# EAGLE design ATMEGA328PB_EVAL_R2 (EAGLE 9.6.2)
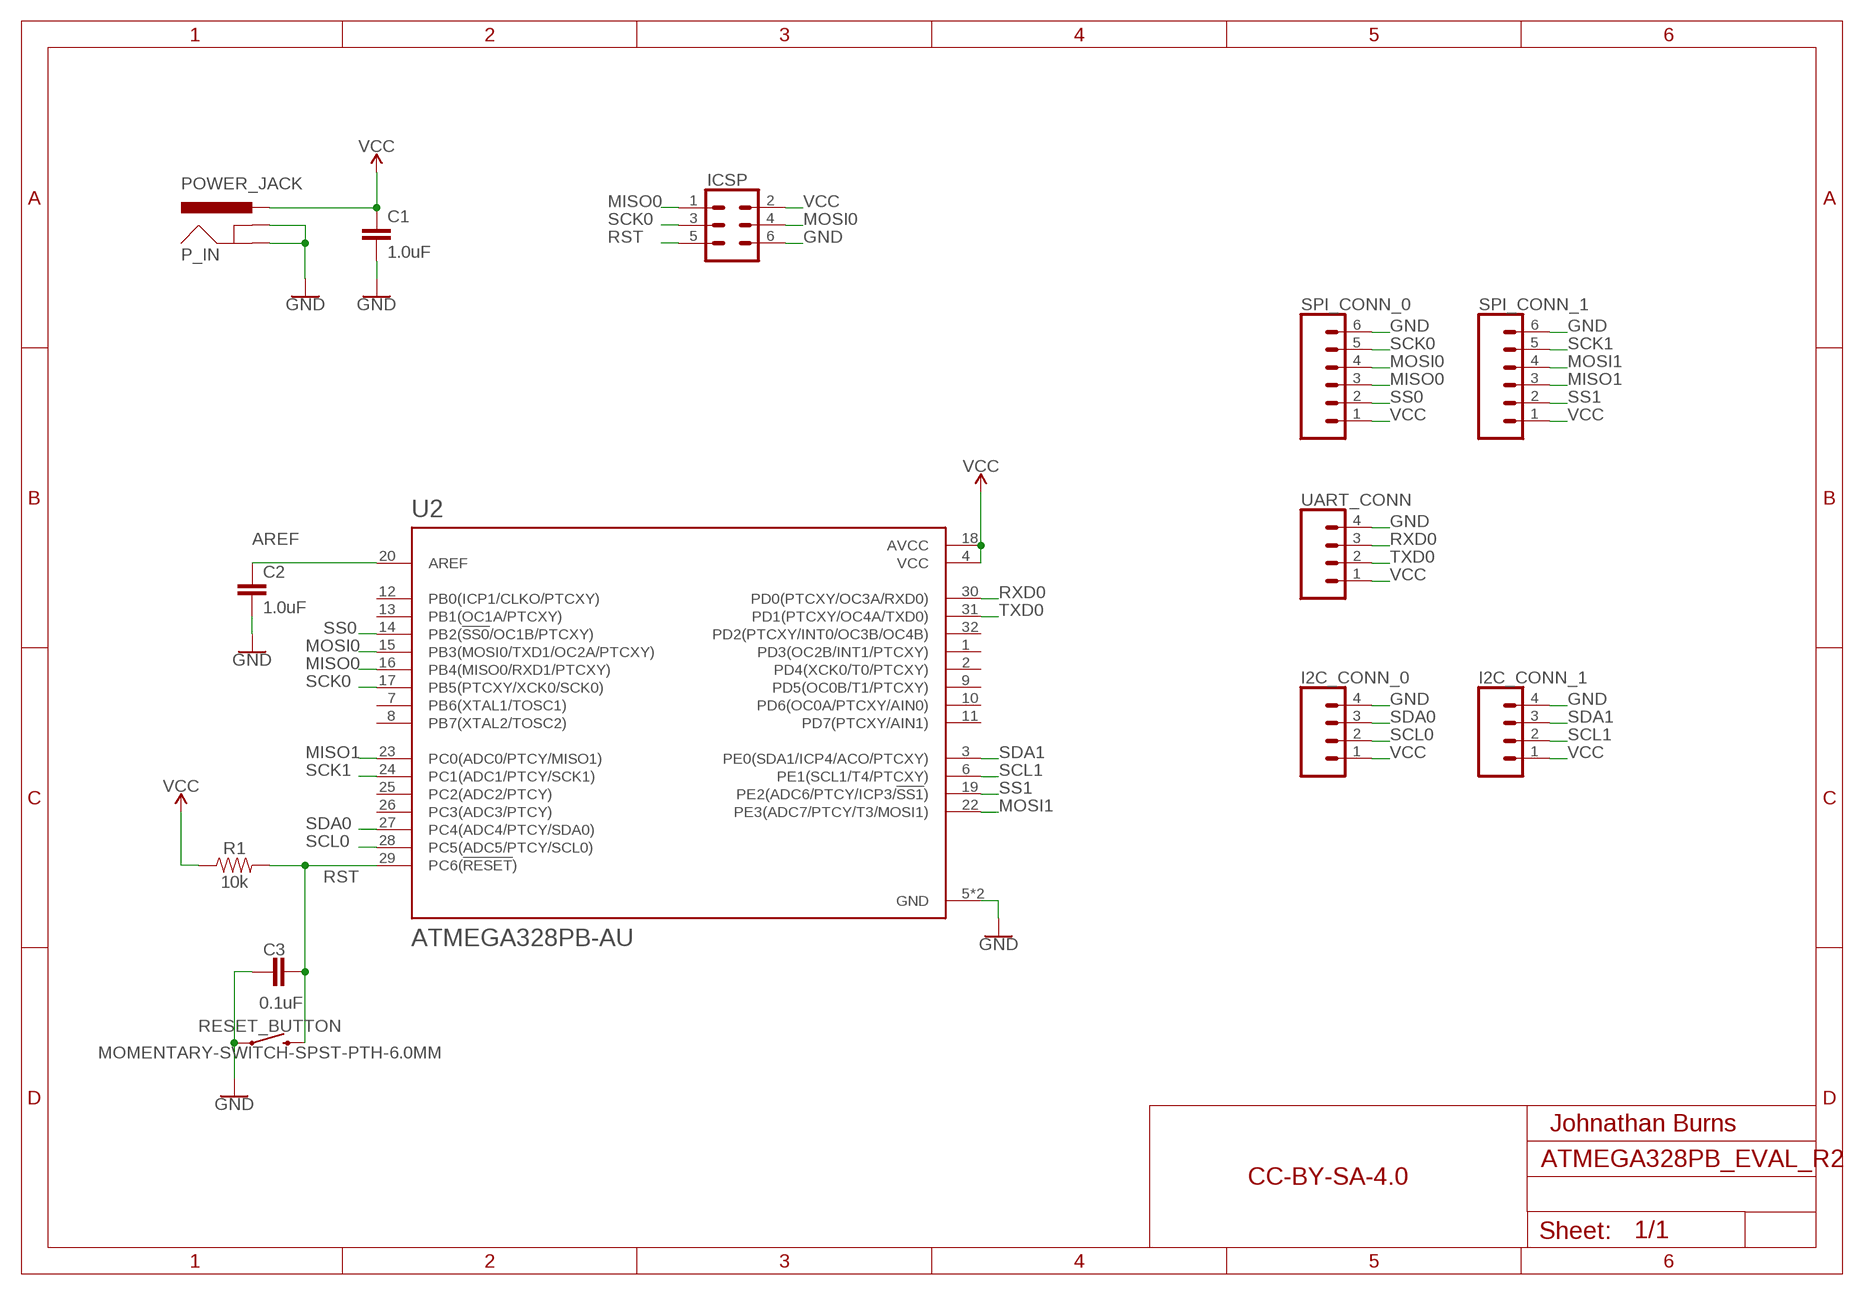
[diagram p0: schematic, sheet 1]

## Parts
C1  1.0uF  1.0UF-0603-16V-10%  [0603]
C2  1.0uF  1.0UF-0603-16V-10%  [0603]
C3  0.1uF  0.1UF-0603-25V-(+80/-20%)  [0603]
I2C_CONN_0  CONN_04  [1X04]
I2C_CONN_1  CONN_04  [1X04]
ICSP  CONN_03X2NO_SILK  [2X3-NS]
P_IN  POWER_JACK  [POWER_JACK_PTH]
R1  10k  10KOHM-0603-1/10W-1%  [0603]
RESET_BUTTON  MOMENTARY-SWITCH-SPST-PTH-6.0MM  [TACTILE_SWITCH_PTH_6.0MM]
SPI_CONN_0  CONN_06SILK_FEMALE_PTH  [1X06]
SPI_CONN_1  CONN_06SILK_FEMALE_PTH  [1X06]
U2  ATMEGA328PB-AU  [QFP80P900X900X120-32N]
UART_CONN  CONN_04  [1X04]

## Nets
AREF: C2.1 U2.20(AREF)
GND: C1.2 C2.2 C3.1 I2C_CONN_0.4 I2C_CONN_1.4 ICSP.6 P_IN.GND P_IN.GNDBREAK RESET_BUTTON.1 SPI_CONN_0.6 SPI_CONN_1.6 U2.5(GND) U2.21(GND) UART_CONN.4
MISO0: ICSP.1 SPI_CONN_0.3 U2.16(PB4(MISO0/RXD1/PTCXY))
MISO1: SPI_CONN_1.3 U2.23(PC0(ADC0/PTCY/MISO1))
MOSI0: ICSP.4 SPI_CONN_0.4 U2.15(PB3(MOSI0/TXD1/OC2A/PTCXY))
MOSI1: SPI_CONN_1.4 U2.22(PE3(ADC7/PTCY/T3/MOSI1))
RST: C3.2 ICSP.5 R1.2 RESET_BUTTON.3 U2.29(PC6(!RESET!))
RXD0: U2.30(PD0(PTCXY/OC3A/RXD0)) UART_CONN.3
SCK0: ICSP.3 SPI_CONN_0.5 U2.17(PB5(PTCXY/XCK0/SCK0))
SCK1: SPI_CONN_1.5 U2.24(PC1(ADC1/PTCY/SCK1))
SCL0: I2C_CONN_0.2 U2.28(PC5(ADC5/PTCY/SCL0))
SCL1: I2C_CONN_1.2 U2.6(PE1(SCL1/T4/PTCXY))
SDA0: I2C_CONN_0.3 U2.27(PC4(ADC4/PTCY/SDA0))
SDA1: I2C_CONN_1.3 U2.3(PE0(SDA1/ICP4/ACO/PTCXY))
SS0: SPI_CONN_0.2 U2.14(PB2(!SS0!/OC1B/PTCXY))
SS1: SPI_CONN_1.2 U2.19(PE2(ADC6/PTCY/ICP3/!SS1!))
TXD0: U2.31(PD1(PTCXY/OC4A/TXD0)) UART_CONN.2
VCC: C1.1 I2C_CONN_0.1 I2C_CONN_1.1 ICSP.2 P_IN.PWR R1.1 SPI_CONN_0.1 SPI_CONN_1.1 U2.4(VCC) U2.18(AVCC) UART_CONN.1
Unconnected: U2.1(PD3(OC2B/INT1/PTCXY)) U2.2(PD4(XCK0/T0/PTCXY)) U2.7(PB6(XTAL1/TOSC1)) U2.8(PB7(XTAL2/TOSC2)) U2.9(PD5(OC0B/T1/PTCXY)) U2.10(PD6(OC0A/PTCXY/AIN0)) U2.11(PD7(PTCXY/AIN1)) U2.12(PB0(ICP1/CLKO/PTCXY)) U2.13(PB1(OC1A/PTCXY)) U2.25(PC2(ADC2/PTCY)) U2.26(PC3(ADC3/PTCY)) U2.32(PD2(PTCXY/INT0/OC3B/OC4B))

## Notes on the sheet
- Johnathan Burns
- CC-BY-SA-4.0

## Library data of the parts
C1 C2 = SparkFun-Capacitors:1.0UF: 1µF ceramic capacitors A capacitor is a passive two-terminal electrical component used to store electrical energy temporarily in an electric field.; PROD_ID: CAP-00868
C3 = SparkFun-Capacitors:0.1UF: 0.1µF ceramic capacitors A capacitor is a passive two-terminal electrical component used to store electrical energy temporarily in an electric field.; PROD_ID: CAP-00810
I2C_CONN_0 I2C_CONN_1 UART_CONN = SparkFun-Connectors:CONN_04: Multi connection point. Often used as Generic Header-pin footprint for 0.1 inch spaced/style header connections On any of the 0.1 inch spaced packages, you can populate with these: Break Away Headers - Straight <https://www.sparkfun.com/products/116> (PRT-00116) Break Away Male Headers - Right Angle <https://www.sparkfun.com/products/553> (PRT-00553) Female Headers <https://www.sparkfun.com/products/115> (PRT-00115) Break Away Headers - Machine Pin <https://www.sparkfun.com/products/117> (PRT-00117) Break Away Female Headers - Swiss Machine Pin <https://www.sparkfun.com/products/743> (PRT-00743) For SCREWTERMINALS and SPRING TERMINALS visit here: Screw Terimnals on SparkFun.com <https://www.sparkfun.com/search/results?term=Screw+Terminals> (5mm/3.5mm/2.54mm spacing) This device is also useful as a general connection point to wire up your design to another part of your project. Our various solder wires solder well into these plated through hole pads. Hook-Up Wire - Assortment (Stranded, 22 AWG) <https://www.sparkfun.com/products/11375> (PRT-11375) Hook-Up Wire - Assortment (Solid Core, 22 AWG) <https://www.sparkfun.com/products/11367> (PRT-11367) View the entire wire category on our website here <https://www.sparkfun.com/categories/141> Special notes: Molex polarized connector foot print use with SKU : PRT-08231 with associated crimp pins and housings. 1MM SMD Version SKU: PRT-10208; PROD_ID: CONN-09696
ICSP = SparkFun-Connectors:CONN_03X2: Multi connection point. Often used as Generic Header-pin footprint for 0.1 inch spaced/style header connections You can populate with any combo of single row headers, but if you'd like an exact match, check these: Header - 2x3 (Male, 0.1") <https://www.sparkfun.com/products/12807> (PRT-12807) Header - 2x3 (Female, 0.1") <https://www.sparkfun.com/products/13010> (PRT-13010) 2x3 Pin Shrouded Header <https://www.sparkfun.com/products/10877> (PRT-10877) On any of the 0.1 inch spaced packages, you can populate with these: Break Away Headers - Straight <https://www.sparkfun.com/products/116> (PRT-00116) Break Away Male Headers - Right Angle <https://www.sparkfun.com/products/553> (PRT-00553) Female Headers <https://www.sparkfun.com/products/115> (PRT-00115) Break Away Headers - Machine Pin <https://www.sparkfun.com/products/117> (PRT-00117) Break Away Female Headers - Swiss Machine Pin <https://www.sparkfun.com/products/743> (PRT-00743) Special note: the shrouded connector mates well with our 3x2 ribbon cables: Ribbon Crimp Connector - 6-pin (2x3, Female) <https://www.sparkfun.com/products/10651> (PRT-10651) Ribbon Cable - 6 wire (15ft) <https://www.sparkfun.com/products/10646> (PRT-10646)
P_IN = SparkFun-Connectors:POWER_JACK: Power Jack Connector This is the standard 5.5mm barrel jack for power. The PTH is the most common, proven, reliable, footprint. The Slot footprint only works if the mill layer is transmitted to the PCB fab house so be warned. Here are the connectors we sell at SparkFun: DC Barrel Power Jack/Connector <https://www.sparkfun.com/products/119> (PRT-00119) DC Barrel Power Jack/Connector (SMD) <https://www.sparkfun.com/products/12748> (PRT-12748) DC Barrel Jack Adapter - Breadboard Compatible <https://www.sparkfun.com/products/10811> (PRT-10811) It is used on this SparkFun product (and many, many others): SparkFun RedBoard - Programmed with Arduino <https://www.sparkfun.com/products/12757> (DEV-12757) Also, if you need a mating power supply or connector, please check these out: Wall Adapter Power Supply - 9VDC 650mA <https://www.sparkfun.com/products/298> (TOL-00298) DC Barrel Jack Adapter - Male <https://www.sparkfun.com/products/10287> (PRT-10287); PROD_ID: CONN-08197
R1 = SparkFun-Resistors:10KOHM: 10kΩ resistor A resistor is a passive two-terminal electrical component that implements electrical resistance as a circuit element. Resistors act to reduce current flow, and, at the same time, act to lower voltage levels within circuits. - Wikipedia; PROD_ID: RES-00824
RESET_BUTTON = SparkFun-Switches:MOMENTARY-SWITCH-SPST: Momentary Switch (Pushbutton) - SPST Normally-open (NO) SPST momentary switches (buttons, pushbuttons). Variants PTH-12MM - 12mm square, through-hole Momentary Pushbutton Switch - 12mm Square <https://www.sparkfun.com/products/9190> (COM-09190) PTH-6.0MM, PTH-6.0MM-KIT - 6.0mm square, through-hole Mini Pushbutton Switch <https://www.sparkfun.com/products/97> (COM-00097) KIT package intended for soldering kit's - only one side of pads' copper is exposed. PTH-RIGHT-ANGLE-KIT - Right-angle, through-hole Right Angle Tactile Button <https://www.sparkfun.com/products/10791> - Used on SparkFun BigTime Watch Kit <https://www.sparkfun.com/products/11734> SMD-12MM - 12mm square, surface-mount Tactile Button - SMD (12mm) <https://www.sparkfun.com/products/12993> (COM-12993) Used on SparkFun PicoBoard <https://www.sparkfun.com/products/11888> SMD-4.5MM - 4.5mm Square Trackball Switch Used on SparkFun Blackberry Trackballer Breakout <https://www.sparkfun.com/products/13169> SMD-4.6MMX2.8MM - 4.60mm x 2.80mm, surface mount Used on SparkFun SAMD21 Mini Breakout <https://www.sparkfun.com/products/13664> SMD-5.2MM, SMD-5.2-REDUNDANT - 5.2mm square, surface-mount Mini Pushbutton Switch - SMD <https://www.sparkfun.com/products/8720> (COM-08720) Used on Arduino Pro Mini <https://www.sparkfun.com/products/11114> REDUNDANT package connects both switch circuits together SMD-6.0X3.5MM - 6.0 x 3.5mm, surface mount Momentary Reset Switch SMD <https://www.sparkfun.com/products/8229> (COM-08229) SMD-6.2MM-TALL - 6.2mm square, surface mount Tactile Button - SMD (6mm) <https://www.sparkfun.com/products/12992> Used on SparkFun Digital Sandbox <https://www.sparkfun.com/products/12651> SMD-RIGHT-ANGLE - Right-angle, surface mount Used on SparkFun Block for Intel® Edison - Arduino <https://www.sparkfun.com/products/13036>; PROD_ID: SWCH-08441; SF_SKU: COM-00097
SPI_CONN_0 SPI_CONN_1 = SparkFun-Connectors:CONN_06: Multi connection point. Often used as Generic Header-pin footprint for 0.1 inch spaced/style header connections On any of the 0.1 inch spaced packages, you can populate with these: Break Away Headers - Straight <https://www.sparkfun.com/products/116> (PRT-00116) Break Away Male Headers - Right Angle <https://www.sparkfun.com/products/553> (PRT-00553) Female Headers <https://www.sparkfun.com/products/115> (PRT-00115) Break Away Headers - Machine Pin <https://www.sparkfun.com/products/117> (PRT-00117) Break Away Female Headers - Swiss Machine Pin <https://www.sparkfun.com/products/743> (PRT-00743) Arduino Stackable Header - 6 Pin <https://www.sparkfun.com/products/9280> (PRT-09280) For SCREWTERMINALS and SPRING TERMINALS visit here: Screw Terimnals on SparkFun.com <https://www.sparkfun.com/search/results?term=Screw+Terminals> (5mm/3.5mm/2.54mm spacing) This device is also useful as a general connection point to wire up your design to another part of your project. Our various solder wires solder well into these plated through hole pads. Hook-Up Wire - Assortment (Stranded, 22 AWG) <https://www.sparkfun.com/products/11375> (PRT-11375) Hook-Up Wire - Assortment (Solid Core, 22 AWG) <https://www.sparkfun.com/products/11367> (PRT-11367) View the entire wire category on our website here <https://www.sparkfun.com/categories/141>; PROD_ID: CONN-08437
U2 = ATMEGA328PB-AU:ATMEGA328PB-AU: ATmega Series 20 MHz 32 KB Flash 2 KB SRAM 8-Bit Microcontroller - TQFP-32 Check prices <https://pricing.snapeda.com/parts/ATMEGA328PB-AU/Microchip%20Technology%20/%20Atmel/view-part?ref=eda>; AVAILABILITY: Not in stock; DESCRIPTION: AVR AVR® ATmega, Functional Safety (FuSa) Microcontroller IC 8-Bit 20MHz 32KB (16K x 16) FLASH 32-TQFP (7x7); MF: Microchip Technology / Atmel; MP: ATMEGA328PB-AU; PACKAGE: TQFP-32 Microchip Technology / Atmel; PRICE: None

## Board
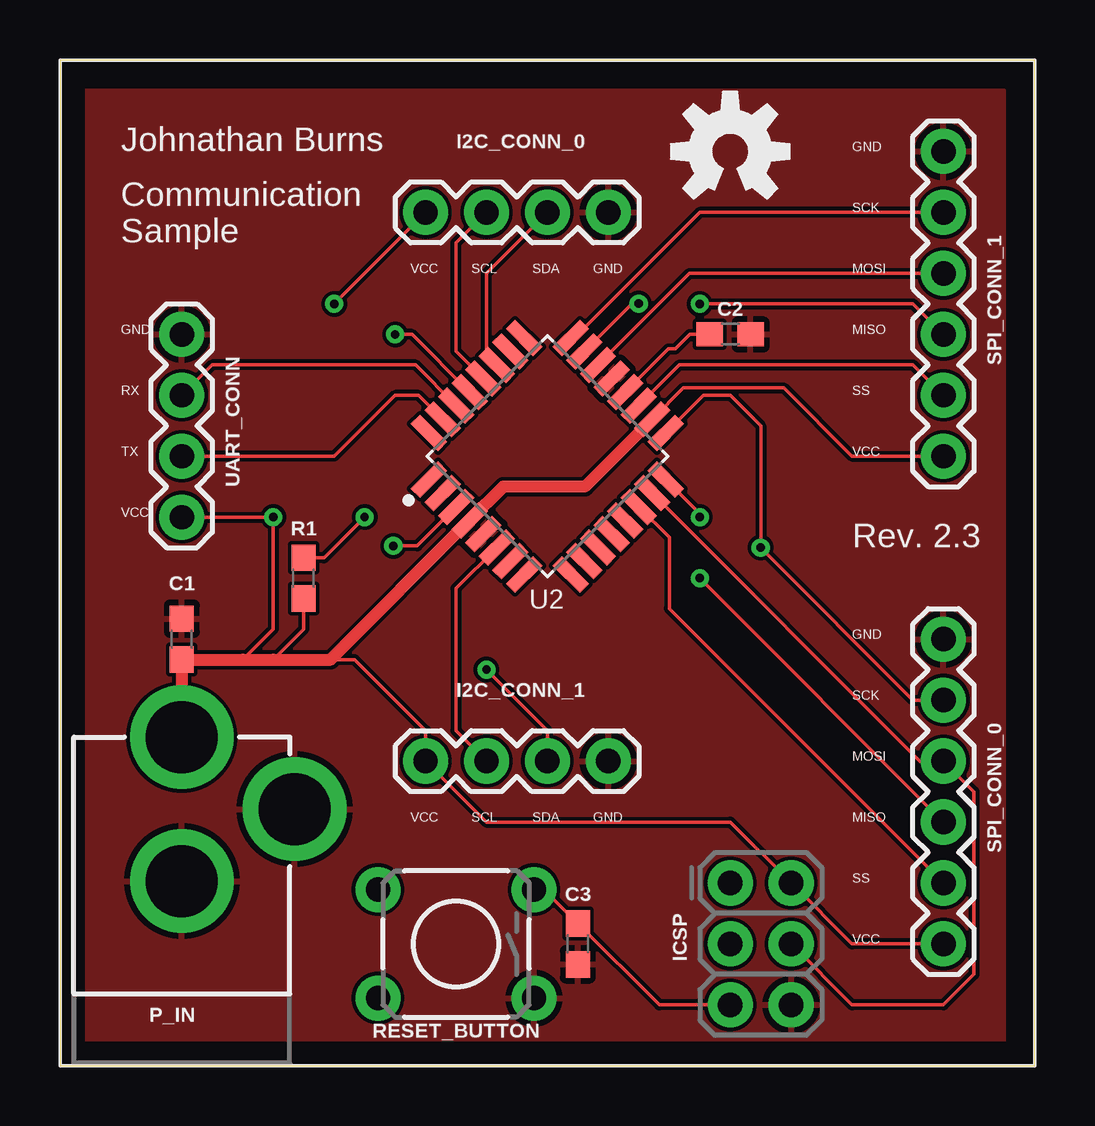
[diagram p1: board, top side]
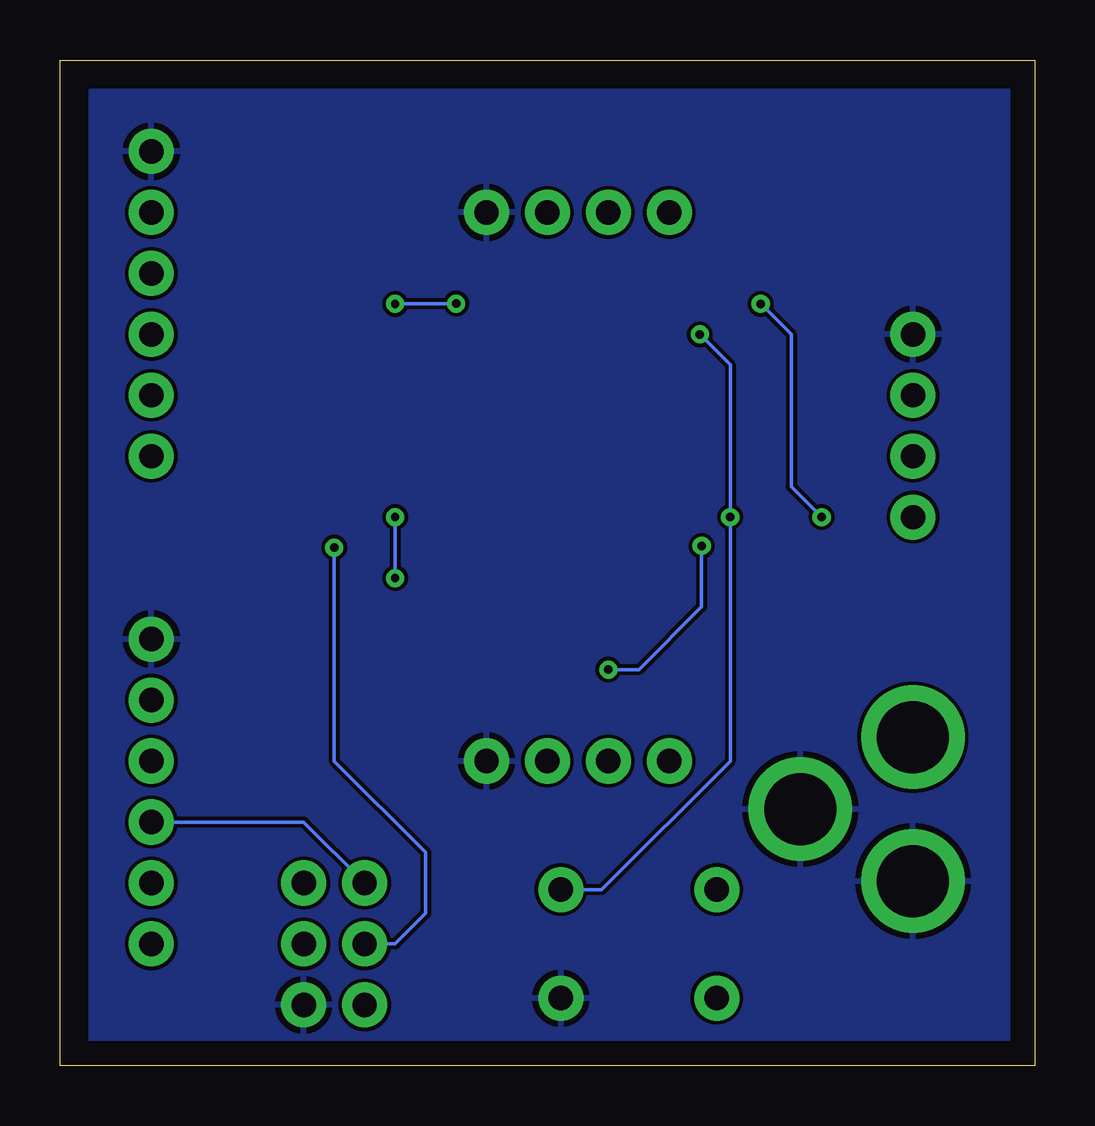
[diagram p2: board, bottom side, seen from below]

Size 40.64 x 41.91 mm. Coordinates in mm from the lower left corner, seen from the top.
Outline: 0,0 40.64,0 40.64,41.91 0,41.91 0,0
Copper layers (1*16): Top 0.035mm / dielectric 1.5mm / Bottom 0.035mm
Design rules "default": minimum track width 6mil, minimum drill 0.35mm, track to track 6mil, track to pad 6mil, pad to pad 6mil, via to via 6mil, smd to smd 6mil, copper to edge 40mil, drill to drill 6mil, minimum pad ring 10mil, minimum via ring 8mil, stop-mask expansion 4mil, vias tented up to drill 0mil, thermal gap 10mil

### Footprints (pad centres in the part's own frame; a part is rotated, then mirrored left to right if it is on the bottom)
0603 = smd 1.1 x 1: 1 -0.85,0; 2 0.85,0
1X04 = drill 1.016 pad 1.88: 1 0,0; 2 2.54,0; 3 5.08,0; 4 7.62,0
2X3-NS = drill 1.016 pad 1.88: 1 -2.54,-1.27; 2 -2.54,1.27; 3 0,-1.27; 4 0,1.27; 5 2.54,-1.27; 6 2.54,1.27
POWER_JACK_PTH = drill 2.997 pad 4.318: GND 0,7.7; GNDBREAK 4.7,10.7; PWR 0,13.7
TACTILE_SWITCH_PTH_6.0MM = drill 1.016 pad 1.88: 1 -3.251,2.261; 2 3.251,2.261; 3 -3.251,-2.261; 4 3.251,-2.261
1X06 = drill 1.016 pad 1.88: 1 0,0; 2 2.54,0; 3 5.08,0; 4 7.62,0; 5 10.16,0; 6 12.7,0
QFP80P900X900X120-32N = smd 1.6 x 0.55: 1 -4.18,2.8; 2 -4.18,2; 3 -4.18,1.2; 4 -4.18,0.4; 5 -4.18,-0.4; 6 -4.18,-1.2; 7 -4.18,-2; 8 -4.18,-2.8; 17 4.18,-2.8; 18 4.18,-2; 19 4.18,-1.2; 20 4.18,-0.4; 21 4.18,0.4; 22 4.18,1.2; 23 4.18,2; 24 4.18,2.8 | smd 0.55 x 1.6: 9 -2.8,-4.18; 10 -2,-4.18; 11 -1.2,-4.18; 12 -0.4,-4.18; 13 0.4,-4.18; 14 1.2,-4.18; 15 2,-4.18; 16 2.8,-4.18; 25 2.8,4.18; 26 2,4.18; 27 1.2,4.18; 28 0.4,4.18; 29 -0.4,4.18; 30 -1.2,4.18; 31 -2,4.18; 32 -2.8,4.18

### Placement (x,y rotation side)
C1  5.08,17.78 90 top
C2  27.94,30.48 0 top
C3  21.59,5.08 90 top
I2C_CONN_0  15.24,35.56 0 top
I2C_CONN_1  15.24,12.7 0 top
ICSP  29.21,5.08 270 top
OSHW_LOGO  [OSHW-LOGO-M]  27.94,38.1 0 top
P_IN  5.08,0 0 top
R1  10.16,20.32 90 top
RESET_BUTTON  16.51,5.08 180 top
SPI_CONN_0  36.83,5.08 90 top
SPI_CONN_1  36.83,25.4 90 top
U2  20.32,25.4 45 top
UART_CONN  5.08,22.86 90 top

### Tracks (layer width: path | path; a pad name or v marks a point on that pad's centre or on a via)
AREF
  Top 0.152: U2.20 25.36,29.87 25.65,29.87 26.26,30.48 C2.1
GND
  Top 0.152: 21.17,4.23 C3.1
  pour Bottom: 0,0 0,40.64 39.37,40.64 39.37,0
  pour Top: 0,0 0,40.64 39.37,40.64 39.37,0
MISO0  (via drill 0.35)
  Top 0.152: U2.16 26.67,23.01 v26.67,22.86 | v26.67,20.32 SPI_CONN_0.3
  Bottom 0.152: v26.67,22.86 v26.67,20.32 | ICSP.1 30.48,10.16 SPI_CONN_0.3
MISO1  (via drill 0.35)
  Top 0.152: U2.23 23.85,31.76 v24.12,31.76 | v26.67,31.75 35.56,31.75 SPI_CONN_1.3
  Bottom 0.152: v24.12,31.76 v26.66,31.76 v26.67,31.75
MOSI0
  Top 0.152: ICSP.4 33.02,2.54 36.83,2.54 38.1,3.81 38.1,11.43 SPI_CONN_0.4 35.85,12.7 U2.15
MOSI1
  Top 0.152: U2.22 26.24,33.02 SPI_CONN_1.4
RST  (via drill 0.35)
  Top 0.152: RESET_BUTTON.3 20.18,7.34 C3.2 24.98,2.54 ICSP.5 | U2.29 14.67,30.48 v13.97,30.48 | v12.7,22.86 11.43,21.59 11.01,21.17 R1.2
  Bottom 0.152: v13.97,30.48 12.7,29.21 v12.7,22.86 12.7,12.7 18.06,7.34 RESET_BUTTON.3
RXD0
  Top 0.152: U2.30 14.81,29.21 6.35,29.21 UART_CONN.3
SCK0  (via drill 0.35)
  Top 0.152: U2.17 26.82,27.94 27.94,27.94 29.21,26.67 v29.21,21.59 35.56,15.24 SPI_CONN_0.5
  Bottom 0.152: v29.21,21.59 29.21,12.7 25.4,8.89 25.4,6.35 26.67,5.08 ICSP.3
SCK1
  Top 0.152: U2.24 21.45,30.34 26.67,35.56 SPI_CONN_1.5
SCL0
  Top 0.152: U2.28 16.51,29.78 16.51,34.29 I2C_CONN_0.2
SCL1
  Top 0.152: U2.6 16.51,19.89 16.51,13.97 I2C_CONN_1.2
SDA0
  Top 0.152: U2.27 17.78,29.64 17.78,33.02 I2C_CONN_0.3
SDA1  (via drill 0.35)
  Top 0.152: U2.3 14.89,21.67 v13.89,21.67 | v17.78,16.51 20.32,13.97 I2C_CONN_1.3
  Bottom 0.152: v13.89,21.67 13.89,19.13 16.51,16.51 v17.78,16.51
SS0
  Top 0.152: U2.14 25.4,22.02 25.4,19.05 SPI_CONN_0.2
SS1
  Top 0.152: U2.19 25.83,29.21 35.56,29.21 SPI_CONN_1.2
TXD0
  Top 0.152: U2.31 14.95,27.94 13.97,27.94 11.43,25.4 UART_CONN.2
VCC  (via drill 0.35)
  Top 0.152: SPI_CONN_0.1 33.02,5.08 ICSP.2 27.94,10.16 17.78,10.16 I2C_CONN_1.1 15.24,13.97 12.28,16.93 11.28,16.93 | U2.18 25.99,28.25 30.18,28.25 33.02,25.4 SPI_CONN_1.1 | I2C_CONN_0.1 v11.43,31.75 | R1.1 10.16,18.2 8.89,16.93 | UART_CONN.1 v8.89,22.86 8.89,18.2 7.62,16.93
  Top 0.508: P_IN.PWR C1.1 7.62,16.93 8.89,16.93 11.28,16.93 U2.4 18.48,24.13 21.88,24.13 U2.18
  Bottom 0.152: v11.43,31.75 10.16,30.48 10.16,24.13 v8.89,22.86

### Text on the board
tPlace: Johnathan Burns | GND | SCK | Communication / Sample | VCC | SCL | SDA | GND | MOSI | GND | MISO | RX | SS | TX | VCC | VCC | Rev. 2.3 | GND | SCK | MOSI | VCC | SCL | SDA | GND | MISO | SS | VCC